# Altium project Wiring Harness 2019.PrjPcb
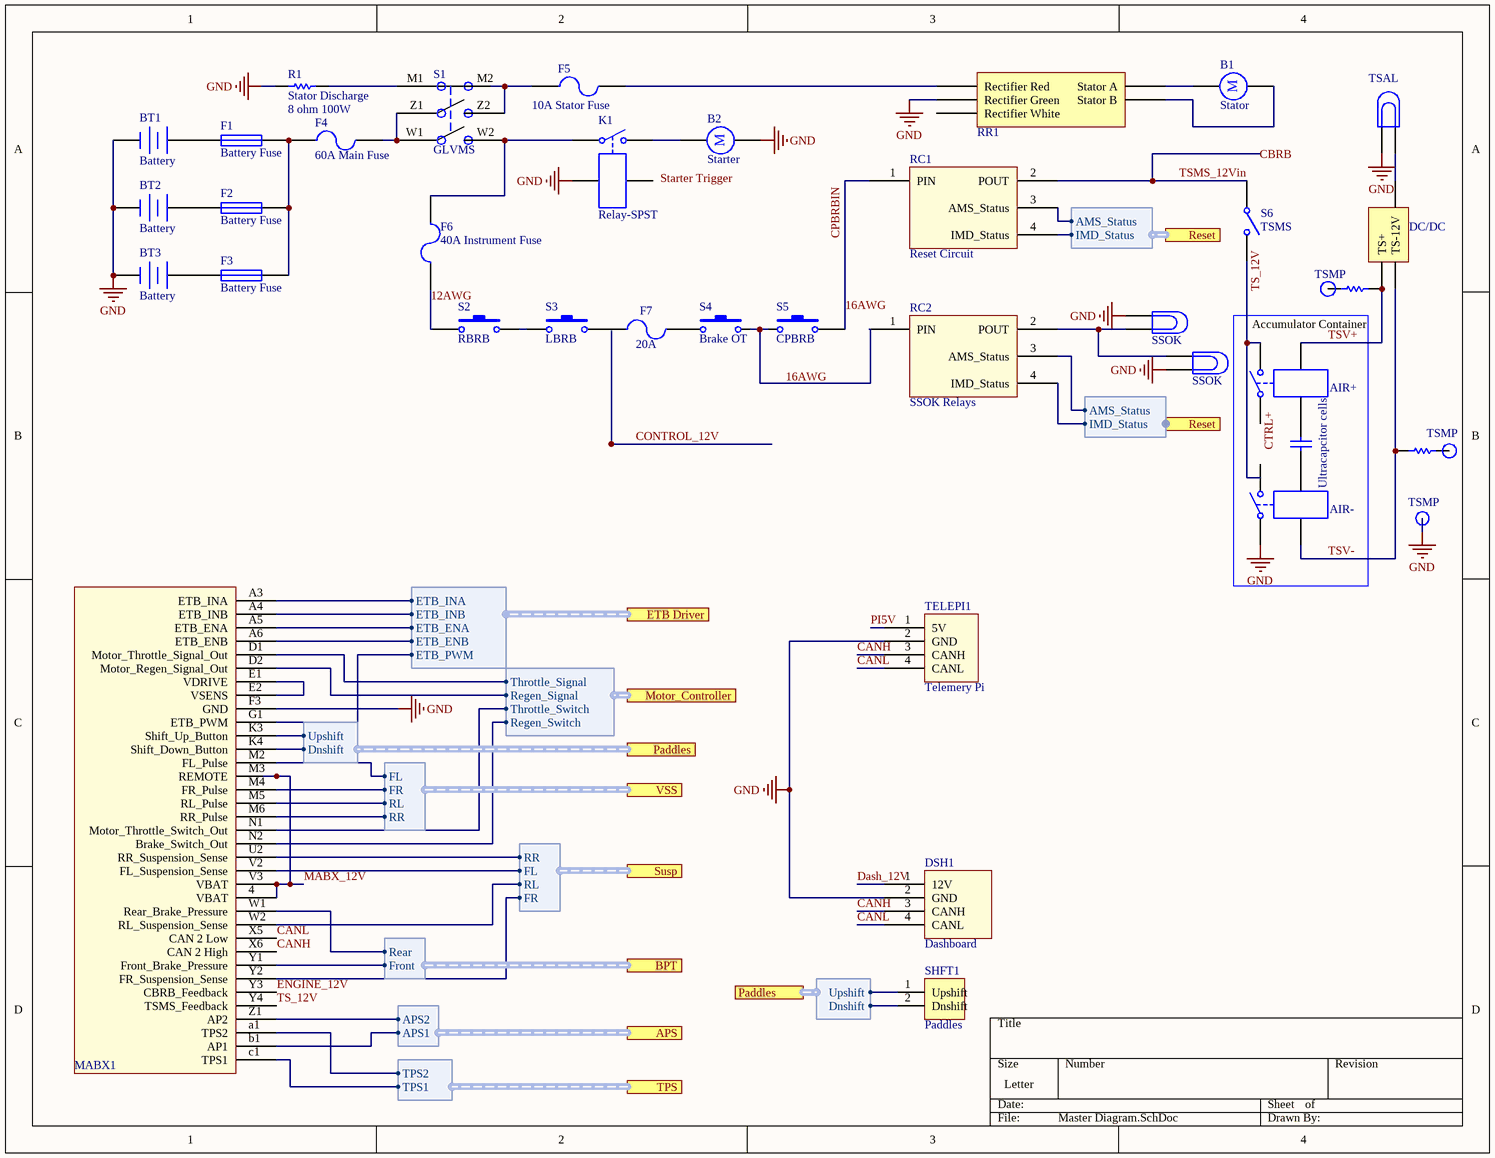
[diagram p0: Master Diagram.SchDoc]
5 sheets, 79 parts. Net scope: flat (ports and power ports of the same name join across sheets).
Sheets:
  Master Diagram.SchDoc
  VD Sensors.SchDoc
  ICE.SchDoc
  TS.SchDoc
  Power.SchDoc

## Sheet Master Diagram.SchDoc
size Letter

### Parts
(Parts that share a designator on the sheet are numbered #1, #2 ... from top to bottom, then left to right.)
B1  Stator  [RB5-10.5]
B2  Starter  [RB5-10.5]
BT1  Battery  [BAT-2]
BT2  Battery  [BAT-2]
BT3  Battery  [BAT-2]
C1  Ultracapcitor cells  [RAD-0.3]
DS1  SSOK  [PIN2]
DS2  SSOK  [PIN2]
DS3#1  TSAL  [PIN2]
DSH1  Dashboard
F1  Battery Fuse  [PIN-W2/E2.8]
F2  Battery Fuse  [PIN-W2/E2.8]
F3  Battery Fuse  [PIN-W2/E2.8]
F4  60A Main Fuse  [PIN-W2/E2.8]
F5  10A Stator Fuse  [PIN-W2/E2.8]
F6  40A Instrument Fuse  [PIN-W2/E2.8]
F7  20A  [PIN-W2/E2.8]
K1  Relay-SPST  [MODULE4]
K3  AIR+  [MODULE4]
K4  AIR-  [MODULE4]
MABX1  MABX  (value not drawn)
P?  DC/DC  [4Pin Molex]
R1  Stator Discharge  value 8 ohm 100W  [AXIAL-0.3]
R5  Res1  [AXIAL-0.3]  (value not drawn)
R6  Res1  [AXIAL-0.3]  (value not drawn)
RC1  Reset Circuit
RC2  SSOK Relays
RR1  Regulator Rectifier  (value not drawn)
S1  GLVMS
S2  RBRB  [SPST-2]
S3  LBRB  [SPST-2]
S4  Brake OT  [SPST-2]
S5  CPBRB  [SPST-2]
S6  TSMS  [SPST-2]
SHFT1  Paddles  [HDR1X2]
TELEPI1  Telemery Pi

### Ports
APS (harness APS), BPT (harness BPT), ETB Driver (harness ETB Harness), Motor_Controller (harness Motor Controller), Paddles (harness Paddles), Reset (harness Reset), Susp (harness Susp), TPS (harness TPS), VSS (harness VSS)

### Harnesses
ETB Harness: ETB_INA, ETB_INB, ETB_ENA, ETB_ENB, ETB_PWM
Motor Controller: Throttle_Signal, Regen_Signal, Throttle_Switch, Regen_Switch
Paddles: Upshift, Dnshift
VSS: FL, FR, RL, RR
Susp: FL, FR, RL, RR
APS: APS2, APS1
TPS: TPS2, TPS1
BPT: Rear, Front
Reset: AMS_Status, IMD_Status

### Nets
GND: B2.2 BT1.2(-) BT2.2(-) BT3.2(-) DS1.1 DS2.2 DS3#1.2 DSH1.2(GND) K1.3 K4.1 MABX1.F3(GND) R1.1 RR1.10(Rectifier_Green) TELEPI1.2(GND)  [project net SENGND]
12AWG: F6.2 S2.1
16AWG: RC1.1(PIN) S5.2
CANH: DSH1.3(CANH) MABX1.X6(CAN_2_High) TELEPI1.3(CANH)
CANL: DSH1.4(CANL) MABX1.X5(CAN_2_Low) TELEPI1.4(CANL)
CBRB: RC1.2(POUT) S6.1(COMMON)  [also labelled TSMS_12Vin]
Dash_12V: DSH1.1(12V)
ENGINE_12V: MABX1.Y3(CBRB_Feedback)
MABX_12V: MABX1.4(VBAT) MABX1.M3(REMOTE) MABX1.V3(VBAT)
PI5V: TELEPI1.1(5V)
TS_12V: MABX1.Y4(TSMS_Feedback)
TSV+: K3.4 P?.4(TS+) R6.2
TSV-: K4.3 P?.2(TS-) R5.1
NetAPS1_3: MABX1.b1(AP1) ; port APS.APS1
NetAPS2_3: MABX1.Z1(AP2) ; port APS.APS2
NetB1_1: B1.1 RR1.7(Stator_A)
NetB1_2: B1.2 RR1.8(Stator_B)
NetB2_1: B2.1 K1.2
NetBPDT1_3: MABX1.Y1(Front_Brake_Pressure) ; port BPT.Front
NetBPDT2_3: MABX1.W1(Rear_Brake_Pressure) ; port BPT.Rear
NetBT1_1: BT1.1(+) F1.1
NetBT2_1: BT2.1(+) F2.1
NetBT3_1: BT3.1(+) F3.1
NetC1_1: C1.1 K4.4
NetC1_2: C1.2 K3.3
NetDS1_2: DS1.2 DS2.1 RC2.2(POUT)
NetDS3#1_1: DS3#1.1 P?.1(12V)
NetESS1_6: RC1.3(AMS_Status) RC2.3(AMS_Status) ; port Reset.AMS_Status
NetETB1_1: MABX1.c1(TPS1) ; port TPS.TPS1
NetETB1_3: MABX1.a1(TPS2) ; port TPS.TPS2
NetETBCTRL1_5: MABX1.A3(ETB_INA) ; port ETB Driver.ETB_INA
NetETBCTRL1_6: MABX1.A5(ETB_ENA) ; port ETB Driver.ETB_ENA
NetETBCTRL1_7: MABX1.G1(ETB_PWM) ; port ETB Driver.ETB_PWM
NetETBCTRL1_9: MABX1.A6(ETB_ENB) ; port ETB Driver.ETB_ENB
NetETBCTRL1_10: MABX1.A4(ETB_INB) ; port ETB Driver.ETB_INB
NetF1_2: F1.2 F2.2 F3.2 F4.1
NetF4_2: F4.2 S1.W1 S1.Z1
NetF5_1: F5.1 S1.M2 S1.Z2
NetF5_2: F5.2 RR1.9(Rectifier_Red)
NetF6_1: F6.1 K1.1 S1.W2
NetIMD1_10: RC1.4(IMD_Status) RC2.4(IMD_Status) ; port Reset.IMD_Status
NetK3_2: K3.2 S6.2(NO)
NetKELLY1_J2-5: MABX1.D1(Motor_Throttle_Signal_Out) ; port Motor_Controller.Throttle_Signal
NetKELLY1_J2-6: MABX1.D2(Motor_Regen_Signal_Out) ; port Motor_Controller.Regen_Signal
NetKELLY1_J2-8: MABX1.N1(Motor_Throttle_Switch_Out) ; port Motor_Controller.Throttle_Switch
NetKELLY1_J2-10: MABX1.N2(Brake_Switch_Out) ; port Motor_Controller.Regen_Switch
NetMABX1_E1: MABX1.E1(VDRIVE) MABX1.E2(VSENS)
NetMABX1_K3: MABX1.K3(Shift_Up_Button) SHFT1.1(Upshift) ; port Paddles.Upshift
NetMABX1_K4: MABX1.K4(Shift_Down_Button) SHFT1.2(Dnshift) ; port Paddles.Dnshift
NetMABX1_M2: MABX1.M2(FL_Pulse) ; port VSS.FL
NetMABX1_M4: MABX1.M4(FR_Pulse) ; port VSS.FR
NetMABX1_M5: MABX1.M5(RL_Pulse) ; port VSS.RL
NetMABX1_M6: MABX1.M6(RR_Pulse) ; port VSS.RR
NetMABX1_U2: MABX1.U2(RR_Suspension_Sense) ; port Susp.RR
NetMABX1_V2: MABX1.V2(FL_Suspension_Sense) ; port Susp.FL
NetMABX1_W2: MABX1.W2(RL_Suspension_Sense) ; port Susp.RL
NetMABX1_Y2: MABX1.Y2(FR_Suspension_Sense) ; port Susp.FR
NetR1_2: R1.2 S1.M1
NetRC2_1: RC2.1(PIN) S4.2 S5.1
NetS2_2: S2.2 S3.1

Not connected (* = marked no-connect by the designer): F7 1 2; K1 4; K3 1; K4 2; P? 3; R5 2; R6 1; RR1 11(Rectifier_White); S3 2; S4 1

### Notes on the sheet
- (near R6) TSMP
- (near R5) TSMP
- Accumulator Container
- Labels drawn without touching a wire or pin: 16AWG, CPBRBIN, CTRL+, Starter Trigger, TS_12V
- (in symbol Motor) M

### Library data of the parts
B1 B2 = Motor: Motor, General Kind; Published: 24-Mar-1999; LatestRevisionDate: 17-Jul-2002; LatestRevisionNote: Re-released for DXP Platform.; PackageReference: RB5-10.5; Publisher: Altium Limited; PackageDescription: Capacitor (Radial); 2 Leads
BT1-BT3 = Battery: Multicell Battery; Published: 24-Mar-1999; LatestRevisionDate: 17-Jul-2002; LatestRevisionNote: Re-released for DXP Platform.; PackageReference: BAT-2; Publisher: Altium Limited; PackageDescription: Battery; 2 Leads
C1 = Cap: Capacitor; Value: 100pF; Published: 8-Jun-2000; LatestRevisionDate: 17-Jul-2002; LatestRevisionNote: Re-released for DXP Platform.; PackageReference: RAD-0.3; Publisher: Altium Limited; PackageDescription: Radial Cap, Thru-Hole; 2 Leads; 0.3 in Pin Spacing
DS1 DS2 DS3#1 = Lamp: Incandescent Bulb; Published: 24-Mar-1999; LatestRevisionDate: 17-Jul-2002; LatestRevisionNote: Re-released for DXP Platform.; PackageReference: PIN2; Publisher: Altium Limited
DSH1 = Dash: Dashboard Connector
F1-F3 = Fuse 1: Fuse; Published: 8-Jun-2000; LatestRevisionDate: 17-Jul-2002; LatestRevisionNote: Re-released for DXP Platform.; PackageReference: PIN-W2/E2.8; Publisher: Altium Limited; PackageDescription: Thru-Hole; 2 Leads
F4-F7 = Fuse 2: Fuse; Published: 8-Jun-2000; LatestRevisionDate: 17-Jul-2002; LatestRevisionNote: Re-released for DXP Platform.; PackageReference: PIN-W2/E2.8; Publisher: Altium Limited; PackageDescription: Thru-Hole; 2 Leads
K1 K3 K4 = Relay-SPST: Single-Pole Single-Throw Relay; Published: 24-Mar-1999; LatestRevisionDate: 17-Jul-2002; LatestRevisionNote: Re-released for DXP Platform.; PackageReference: MODULE4; Publisher: Altium Limited
MABX1 = MABX: MicroAutoBox II in 2019 Layout V1
P? = 4Pin Molex: Supplier Part Number: WM3801-ND
R1 = Res1: Resistor; Published: 8-Jun-2000; LatestRevisionDate: 17-Jul-2002; LatestRevisionNote: Re-released for DXP Platform.; PackageReference: AXIAL-0.3; Publisher: Altium Limited; PackageDescription: Axial Device, Thru-Hole; 2 Leads; 0.3 in Pin Spacing
R5 R6 = Res1: Resistor; Value: 1K; Published: 8-Jun-2000; LatestRevisionDate: 17-Jul-2002; LatestRevisionNote: Re-released for DXP Platform.; PackageReference: AXIAL-0.3; Publisher: Altium Limited; PackageDescription: Axial Device, Thru-Hole; 2 Leads; 0.3 in Pin Spacing
RC1 RC2 = Reset: Reset Circuit for 2019 Rules
RR1 = Stator Rectifier
S2-S5 = SW-PB: Switch; Published: 24-Mar-1999; LatestRevisionDate: 17-Jul-2002; LatestRevisionNote: Re-released for DXP Platform.; PackageReference: SPST-2; Publisher: Altium Limited; PackageDescription: Switch; 2 Leads
S6 = SW-SPST: Single-Pole, Single-Throw Switch; Published: 24-Mar-1999; LatestRevisionDate: 17-Jul-2002; LatestRevisionNote: Re-released for DXP Platform.; PackageReference: SPST-2; Publisher: Altium Limited; PackageDescription: Switch; 2 Leads
SHFT1 = Header 2: Header, 2-Pin; LatestRevisionDate: 17-Jul-2002; LatestRevisionNote: Re-released for DXP Platform.; Publisher: Altium Limited
TELEPI1 = TELEPI: Raspberry Pi used for telemetry

## Sheet VD Sensors.SchDoc
size A4
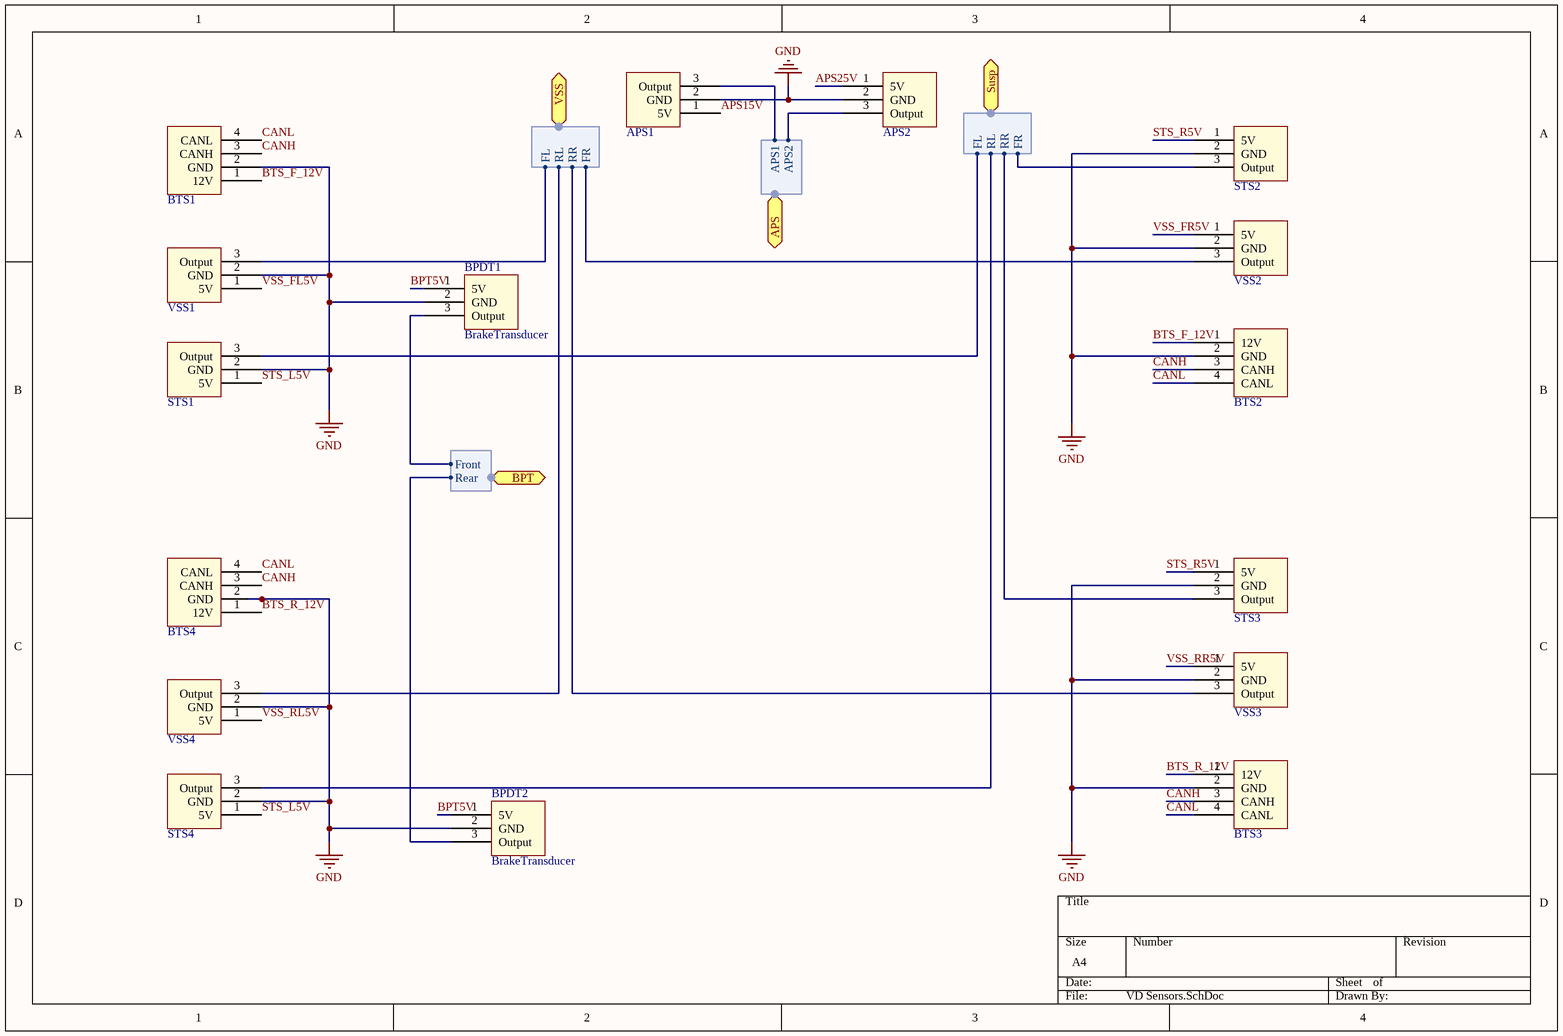
[diagram p1: VD Sensors.SchDoc]

### Parts
APS1  APS  (value not drawn)
APS2  APS  (value not drawn)
BPDT1  BrakeTransducer
BPDT2  BrakeTransducer
BTS1  BTS  (value not drawn)
BTS2  BTS  (value not drawn)
BTS3  BTS  (value not drawn)
BTS4  BTS  (value not drawn)
STS1  Susp  (value not drawn)
STS2  Susp  (value not drawn)
STS3  Susp  (value not drawn)
STS4  Susp  (value not drawn)
VSS1  VSS  (value not drawn)
VSS2  VSS  (value not drawn)
VSS3  VSS  (value not drawn)
VSS4  VSS  (value not drawn)

### Ports
APS (harness APS), BPT (harness BPT), Susp (harness Susp), VSS (harness VSS)

### Harnesses
VSS: FL, FR, RL, RR
Susp: FL, FR, RL, RR
APS: APS2, APS1
BPT: Rear, Front

### Nets
GND: APS1.2(GND) APS2.2(GND) BPDT1.2(GND) BPDT2.2(GND) BTS1.2(GND) BTS2.2(GND) BTS3.2(GND) BTS4.2(GND) STS1.2(GND) STS2.2(GND) STS3.2(GND) STS4.2(GND) VSS1.2(GND) VSS2.2(GND) VSS3.2(GND) VSS4.2(GND)  [project net SENGND]
APS15V: APS1.1(5V)
APS25V: APS2.1(5V)
BPT5V: BPDT1.1(5V) BPDT2.1(5V)
BTS_F_12V: BTS1.1(12V) BTS2.1(12V)
BTS_R_12V: BTS3.1(12V) BTS4.1(12V)
CANH: BTS1.3(CANH) BTS2.3(CANH) BTS3.3(CANH) BTS4.3(CANH)
CANL: BTS1.4(CANL) BTS2.4(CANL) BTS3.4(CANL) BTS4.4(CANL)
STS_L5V: STS1.1(5V) STS4.1(5V)
STS_R5V: STS2.1(5V) STS3.1(5V)
VSS_FL5V: VSS1.1(5V)
VSS_FR5V: VSS2.1(5V)
VSS_RL5V: VSS4.1(5V)
VSS_RR5V: VSS3.1(5V)
NetAPS1_3: APS1.3(Output) ; port APS.APS1
NetAPS2_3: APS2.3(Output) ; port APS.APS2
NetBPDT1_3: BPDT1.3(Output) ; port BPT.Front
NetBPDT2_3: BPDT2.3(Output) ; port BPT.Rear
NetMABX1_M2: VSS1.3(Output) ; port VSS.FL
NetMABX1_M4: VSS2.3(Output) ; port VSS.FR
NetMABX1_M5: VSS4.3(Output) ; port VSS.RL
NetMABX1_M6: VSS3.3(Output) ; port VSS.RR
NetMABX1_U2: STS3.3(Output) ; port Susp.RR
NetMABX1_V2: STS1.3(Output) ; port Susp.FL
NetMABX1_W2: STS4.3(Output) ; port Susp.RL
NetMABX1_Y2: STS2.3(Output) ; port Susp.FR

### Library data of the parts
APS1 APS2 = APS: Accelerator Pedal Sensor
BPDT1 BPDT2 = BrakeTransducer: Brake Pressure Transducer
BTS1-BTS4 = BTS: Brake Temperature Sensor
STS1-STS4 = VSS: Suspension Travel Sensor
VSS1-VSS4 = VSS: Vehicle Speed Sensor

## Sheet ICE.SchDoc
size A4
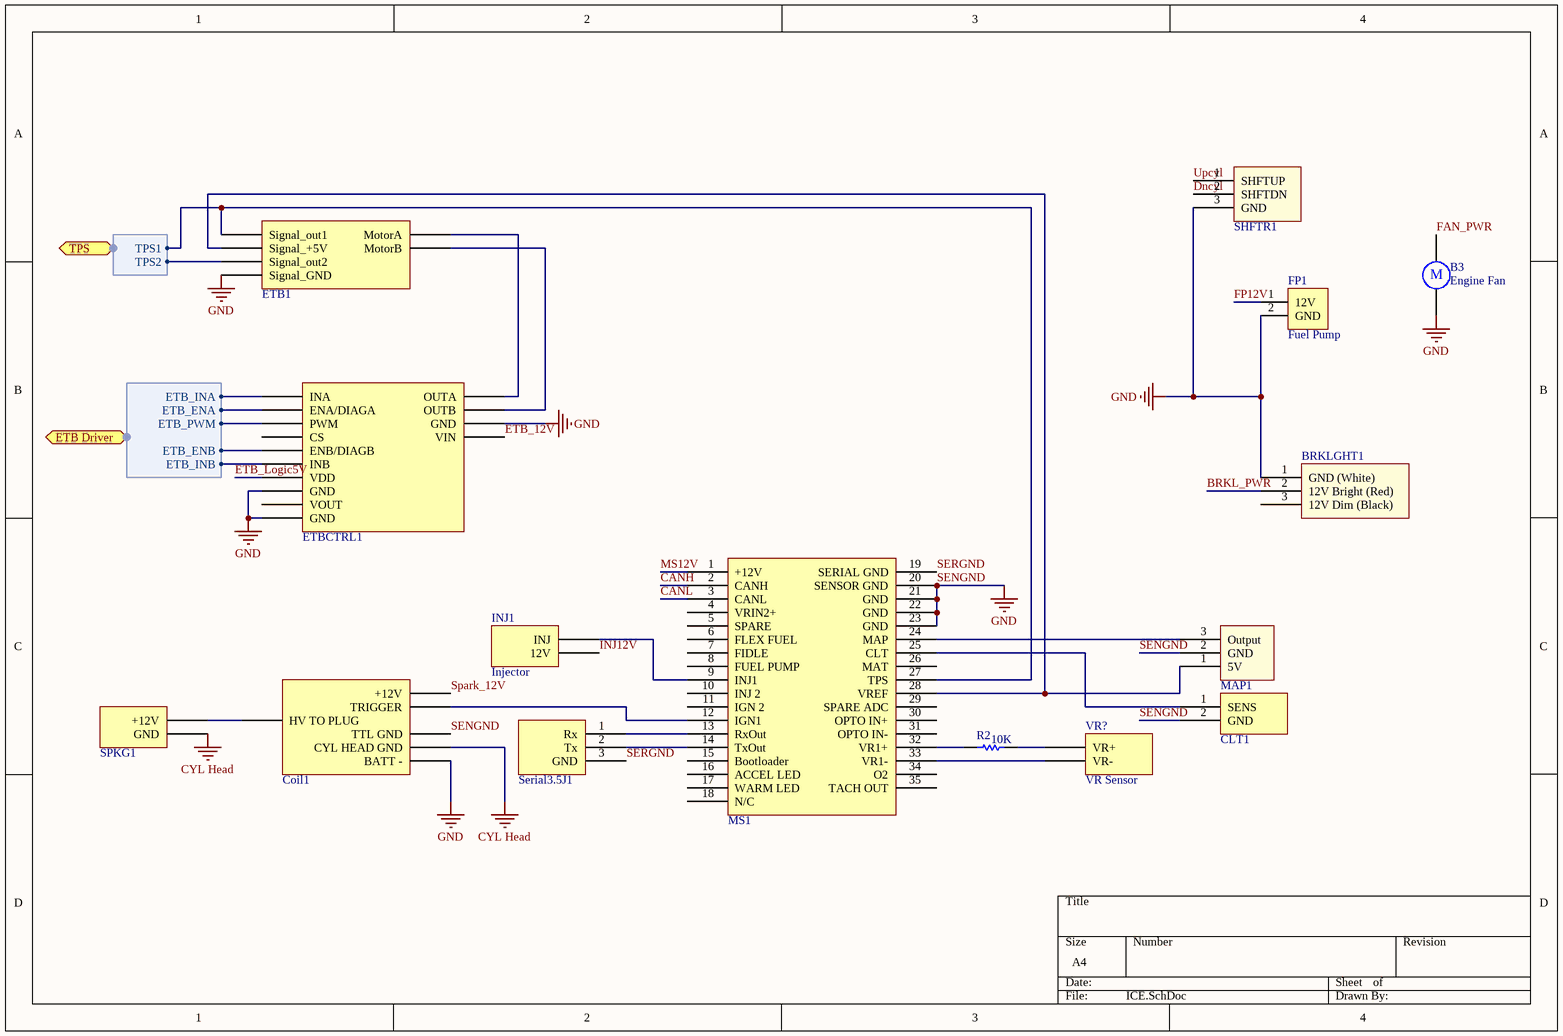
[diagram p2: ICE.SchDoc]

### Parts
B3  Engine Fan  [RB5-10.5]
BRKLGHT1  BRKLGHT  (value not drawn)
CLT1  CLT  (value not drawn)
Coil1  Spark Plug Coil  (value not drawn)
ETB1  ETB  (value not drawn)
ETBCTRL1  ETB Controller  (value not drawn)
FP1  Fuel Pump  [HDR1X2]
INJ1  Injector
MAP1  MAP  (value not drawn)
MS1  Microsquirt  (value not drawn)
R2  value 10K  [AXIAL-0.3]  (hidden comment: Res1)
Serial3.5J1  Serial Jack  (value not drawn)
SHFTR1  Shifter  (value not drawn)
SPKG1  Spark Plug  (value not drawn)
VR?  VR Sensor

### Ports
ETB Driver (harness ETB Harness), TPS (harness TPS)

### Harnesses
ETB Harness: ETB_INA, ETB_INB, ETB_ENA, ETB_ENB, ETB_PWM
TPS: TPS2, TPS1

### Nets
CYL Head: Coil1.6(CYL_HEAD_GND) SPKG1.2(GND)
SENGND: B3.2 BRKLGHT1.1(GND_(White)) CLT1.2(GND) Coil1.2(TTL_GND) Coil1.4(BATT_-) ETB1.4(Signal_GND) ETBCTRL1.3(GND) ETBCTRL1.12(GND) ETBCTRL1.14(GND) FP1.2(GND) MAP1.2(GND) MS1.20(SENSOR_GND) MS1.21(GND) MS1.22(GND) MS1.23(GND) SHFTR1.3(GND)  [also labelled GND]
BRKL_PWR: BRKLGHT1.2(12V_Bright_(Red))
CANH: MS1.2(CANH)
CANL: MS1.3(CANL)
Dncyl: SHFTR1.2(SHFTDN)
ETB_12V: ETBCTRL1.4(VIN)
ETB_Logic5V: ETBCTRL1.11(VDD)
FAN_PWR: B3.1
FP12V: FP1.1(12V)
INJ12V: INJ1.2(12V)
MS12V: MS1.1(+12V)
SERGND: MS1.19(SERIAL_GND) Serial3.5J1.3(GND)
Spark_12V: Coil1.1(+12V)
Upcyl: SHFTR1.1(SHFTUP)
NetCLT1_1: CLT1.1(SENS) MS1.25(CLT)
NetCoil1_3: Coil1.3(HV_TO_PLUG) SPKG1.1(+12V)
NetCoil1_5: Coil1.5(TRIGGER) MS1.12(IGN1)
NetETB1_1: ETB1.1(Signal_out1) MS1.27(TPS) ; port TPS.TPS1
NetETB1_2: ETB1.2(Signal_+5V) MAP1.1(5V) MS1.28(VREF)
NetETB1_3: ETB1.3(Signal_out2) ; port TPS.TPS2
NetETB1_5: ETB1.5(MotorA) ETBCTRL1.1(OUTA)
NetETB1_6: ETB1.6(MotorB) ETBCTRL1.2(OUTB)
NetETBCTRL1_5: ETBCTRL1.5(INA) ; port ETB Driver.ETB_INA
NetETBCTRL1_6: ETBCTRL1.6(ENA/DIAGA) ; port ETB Driver.ETB_ENA
NetETBCTRL1_7: ETBCTRL1.7(PWM) ; port ETB Driver.ETB_PWM
NetETBCTRL1_9: ETBCTRL1.9(ENB/DIAGB) ; port ETB Driver.ETB_ENB
NetETBCTRL1_10: ETBCTRL1.10(INB) ; port ETB Driver.ETB_INB
NetINJ1_1: INJ1.1(INJ) MS1.9(INJ1)
NetMAP1_3: MAP1.3(Output) MS1.24(MAP)
NetMS1_13: MS1.13(RxOut) Serial3.5J1.1(Rx)
NetMS1_14: MS1.14(TxOut) Serial3.5J1.2(Tx)
NetMS1_32: MS1.32(VR1+) R2.1
NetMS1_33: MS1.33(VR1-) VR?.2(VR-)
NetR2_2: R2.2 VR?.1(VR+)

Not connected (* = marked no-connect by the designer): BRKLGHT1 3(12V_Dim_(Black)); ETBCTRL1 8(CS) 13(VOUT); MS1 4(VRIN2+) 5(SPARE) 6(FLEX_FUEL) 7(FIDLE) 8(FUEL_PUMP) 10(INJ_2) 11(IGN_2) 15(Bootloader) 16(ACCEL_LED) 17(WARM_LED) 18(N/C) 26(MAT) 29(SPARE_ADC) 30(OPTO_IN+) 31(OPTO_IN-) 34(O2) 35(TACH_OUT)

### Notes on the sheet
- (in symbol Motor) M

### Library data of the parts
B3 = Motor: Motor, General Kind; Published: 24-Mar-1999; LatestRevisionDate: 17-Jul-2002; LatestRevisionNote: Re-released for DXP Platform.; PackageReference: RB5-10.5; Publisher: Altium Limited; PackageDescription: Capacitor (Radial); 2 Leads
BRKLGHT1 = BRKLGHT: Brake light with dim and bright operation
CLT1 = CLT: Coolant Temperature Sensor
ETB1 = ETB: Electronic Throttle Body
ETBCTRL1 = ETB Controller: ETB Controller Board
FP1 = Header 2: Header, 2-Pin; LatestRevisionDate: 17-Jul-2002; LatestRevisionNote: Re-released for DXP Platform.; Publisher: Altium Limited
MAP1 = VSS: Manifold Air Pressure Sensor
MS1 = Microsquirt: Microsquirt EFI Controller
R2 = Res1: Resistor; Published: 8-Jun-2000; LatestRevisionDate: 17-Jul-2002; LatestRevisionNote: Re-released for DXP Platform.; PackageReference: AXIAL-0.3; Publisher: Altium Limited; PackageDescription: Axial Device, Thru-Hole; 2 Leads; 0.3 in Pin Spacing
Serial3.5J1 = Serial Connector: Serial Connector on a 3.5mm plug
SHFTR1 = SHFTR: Shifter Connector
SPKG1 = Spark Plug: Spark Plug with HV Lead Connector
VR? = VR Sensor: Variable Reluctance Sensor

## Sheet TS.SchDoc
size A4
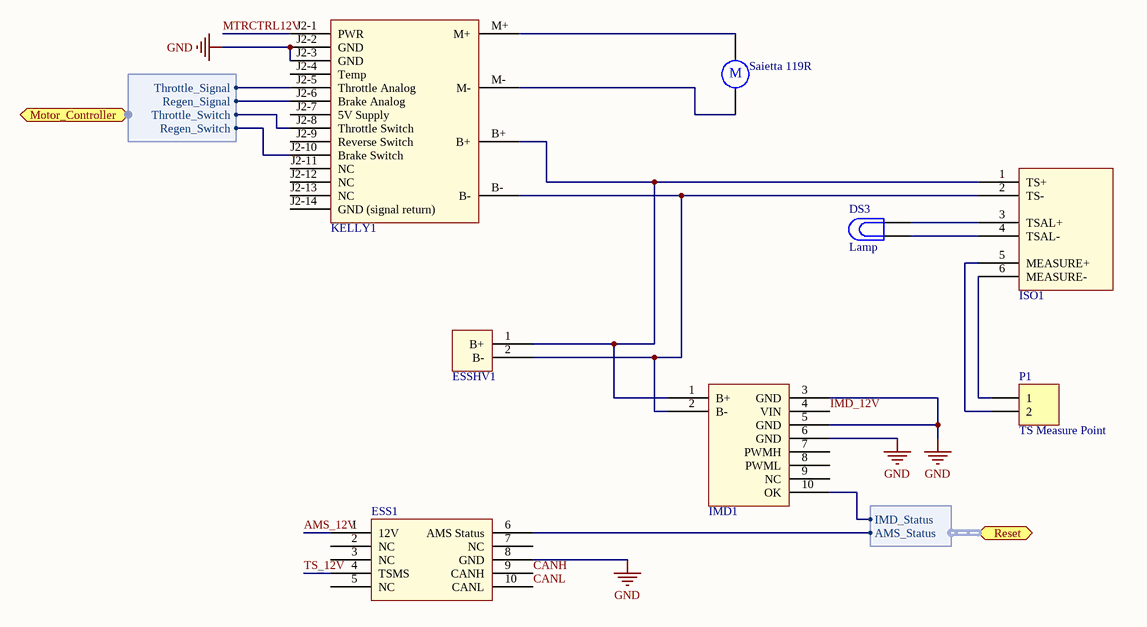
[diagram p3: TS.SchDoc]

### Parts
(Parts that share a designator on the sheet are numbered #1, #2 ... from top to bottom, then left to right.)
B4  Saietta 119R  [RB5-10.5]
DS3#2  Lamp  [PIN2]
ESS1  (no value)
ESSHV1  ESS High Voltage  (value not drawn)
IMD1  IMD  (value not drawn)
ISO1  Isolation Board  (value not drawn)
KELLY1  Kelly MC  (value not drawn)
P1  TS Measure Point  [HDR1X2]

### Ports
Motor_Controller (harness Motor Controller), Reset (harness Reset)

### Harnesses
Motor Controller: Throttle_Signal, Regen_Signal, Throttle_Switch, Regen_Switch
Reset: AMS_Status, IMD_Status

### Nets
GND: ESS1.8(GND) IMD1.3(GND) IMD1.5(GND) IMD1.6(GND) KELLY1.J2-2(GND) KELLY1.J2-3(GND)  [project net SENGND]
AMS_12V: ESS1.1(12V)
CANH: ESS1.9(CANH)
CANL: ESS1.10(CANL)
IMD_12V: IMD1.4(VIN)
MTRCTRL12V: KELLY1.J2-1(PWR)
TS_12V: ESS1.4(TSMS)
NetB4_1: B4.1 KELLY1.M+
NetB4_2: B4.2 KELLY1.M-
NetDS3#2_1: DS3#2.1 ISO1.4(TSAL-)
NetDS3#2_2: DS3#2.2 ISO1.3(TSAL+)
NetESS1_6: ESS1.6(AMS_Status) ; port Reset.AMS_Status
NetESSHV1_1: ESSHV1.1(B+) IMD1.1(B+) ISO1.1(TS+) KELLY1.B+
NetESSHV1_2: ESSHV1.2(B-) IMD1.2(B-) ISO1.2(TS-) KELLY1.B-
NetIMD1_10: IMD1.10(OK) ; port Reset.IMD_Status
NetISO1_5: ISO1.5(MEASURE+) P1.2
NetISO1_6: ISO1.6(MEASURE-) P1.1
NetKELLY1_J2-5: KELLY1.J2-5(Throttle_Analog) ; port Motor_Controller.Throttle_Signal
NetKELLY1_J2-6: KELLY1.J2-6(Brake_Analog) ; port Motor_Controller.Regen_Signal
NetKELLY1_J2-8: KELLY1.J2-8(Throttle_Switch) ; port Motor_Controller.Throttle_Switch
NetKELLY1_J2-10: KELLY1.J2-10(Brake_Switch) ; port Motor_Controller.Regen_Switch

Not connected (* = marked no-connect by the designer): ESS1 2(NC) 3(NC) 5(NC) 7(NC); IMD1 7(PWMH) 8(PWML) 9(NC); KELLY1 J2-4(Temp) J2-7(5V_Supply) J2-9(Reverse_Switch) J2-11(NC) J2-12(NC) J2-13(NC) J2-14(GND_(signal_return))

### Notes on the sheet
- (in symbol Motor) M

### Library data of the parts
B4 = Motor: Motor, General Kind; Published: 24-Mar-1999; LatestRevisionDate: 17-Jul-2002; LatestRevisionNote: Re-released for DXP Platform.; PackageReference: RB5-10.5; Publisher: Altium Limited; PackageDescription: Capacitor (Radial); 2 Leads
DS3#2 = Lamp: Incandescent Bulb; Published: 24-Mar-1999; LatestRevisionDate: 17-Jul-2002; LatestRevisionNote: Re-released for DXP Platform.; PackageReference: PIN2; Publisher: Altium Limited
ESS1 = ESS 10pin
ESSHV1 = ESS HV
IMD1 = IMD: Insulation Monitoring Device
ISO1 = ISO
KELLY1 = Kelly HPM: Kelly KPM 12601 Functional Pinout
P1 = Header 2: Header, 2-Pin; LatestRevisionDate: 17-Jul-2002; LatestRevisionNote: Re-released for DXP Platform.; Publisher: Altium Limited

## Sheet Power.SchDoc
size A4
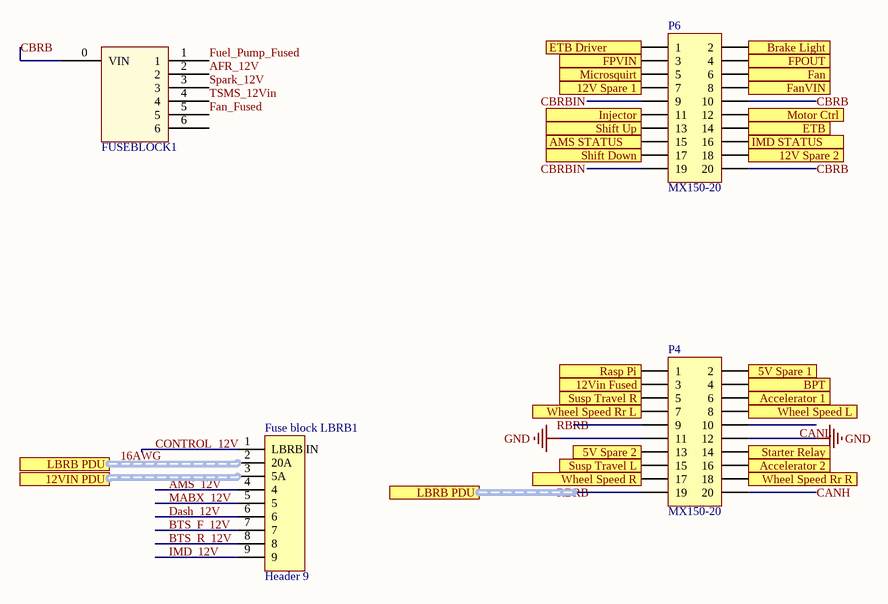
[diagram p4: Power.SchDoc]

### Parts
Fuse_block_LBRB1  Header 9  [HDR1X9]
FUSEBLOCK1  FuseBlock  (value not drawn)
P4  MX150-20  [MX150 20 PIN]
P6  MX150-20  [MX150 20 PIN]

### Ports
5V Spare 1, 5V Spare 2, 12V Spare 1, 12V Spare 2, 12Vin Fused, 12VIN PDU (harness Reset), Accelerator 1, Accelerator 2, AMS STATUS, BPT, Brake Light, ETB, ETB Driver, Fan, FanVIN, FPOUT, FPVIN, IMD STATUS, Injector, LBRB PDU (harness Reset), Microsquirt, Motor Ctrl, Rasp Pi, Shift Down, Shift Up, Starter Relay, Susp Travel L, Susp Travel R, Wheel Speed L, Wheel Speed R, Wheel Speed Rr L, Wheel Speed Rr R

### Nets
GND: P4.11 P4.12  [project net SENGND]
AFR_12V: FUSEBLOCK1.2
CANH: P4.20
CANL: P4.10
CBRB: FUSEBLOCK1.0(VIN) P6.10 P6.20
CBRBIN: P6.9 P6.19
Fan_Fused: FUSEBLOCK1.5
Fuel_Pump_Fused: FUSEBLOCK1.1
RBRB: P4.9 P4.19
Spark_12V: FUSEBLOCK1.3
TSMS_12Vin: FUSEBLOCK1.4
NetP4_1: P4.1 ; port Rasp Pi
NetP4_2: P4.2 ; port 5V Spare 1
NetP4_3: P4.3 ; port 12Vin Fused
NetP4_4: P4.4 ; port BPT
NetP4_5: P4.5 ; port Susp Travel R
NetP4_6: P4.6 ; port Accelerator 1
NetP4_7: P4.7 ; port Wheel Speed Rr L
NetP4_8: P4.8 ; port Wheel Speed L
NetP4_13: P4.13 ; port 5V Spare 2
NetP4_14: P4.14 ; port Starter Relay
NetP4_15: P4.15 ; port Susp Travel L
NetP4_16: P4.16 ; port Accelerator 2
NetP4_17: P4.17 ; port Wheel Speed R
NetP4_18: P4.18 ; port Wheel Speed Rr R
NetP6_1: P6.1 ; port ETB Driver
NetP6_2: P6.2 ; port Brake Light
NetP6_3: P6.3 ; port FPVIN
NetP6_4: P6.4 ; port FPOUT
NetP6_5: P6.5 ; port Microsquirt
NetP6_6: P6.6 ; port Fan
NetP6_7: P6.7 ; port 12V Spare 1
NetP6_8: P6.8 ; port FanVIN
NetP6_11: P6.11 ; port Injector
NetP6_12: P6.12 ; port Motor Ctrl
NetP6_13: P6.13 ; port Shift Up
NetP6_14: P6.14 ; port ETB
NetP6_15: P6.15 ; port AMS STATUS
NetP6_16: P6.16 ; port IMD STATUS
NetP6_17: P6.17 ; port Shift Down
NetP6_18: P6.18 ; port 12V Spare 2

Not connected (* = marked no-connect by the designer): Fuse_block_LBRB1 1(LBRB_IN) 2(20A) 3(5A) 4 5 6 7 8 9; FUSEBLOCK1 6

### Buses and harness runs
harness 16AWG = port LBRB PDU

### Notes on the sheet
- Labels drawn without touching a wire or pin: AMS_12V, BTS_F_12V, BTS_R_12V, CONTROL_12V, Dash_12V, IMD_12V, MABX_12V

### Library data of the parts
Fuse_block_LBRB1 = Header 9: Header, 9-Pin; LatestRevisionDate: 17-Jul-2002; LatestRevisionNote: Re-released for DXP Platform.; Publisher: Altium Limited
FUSEBLOCK1 = FuseBlock: Iztor 6 Way Light Fuse Box Block; Link: https://www.amazon.ca/Terminal-Single-Package-Accessories-Motorhomes/dp/B074K1TJNL/ref=sr_1_9?s=electronics&ie=UTF8&qid=1544502475&sr=1-9&keywords=6+way+fuse+box
P4 P6 = Header 10X2: Header, 10-Pin, Dual row; LatestRevisionDate: 17-Jul-2002; LatestRevisionNote: Re-released for DXP Platform.; Publisher: Altium Limited; Supplier Part Number: WM12752-ND

## Nets that join several sheets
SENGND: Master Diagram (14 pins), VD Sensors (16 pins), ICE (16 pins), TS (6 pins), Power (P4.11 P4.12)
NetAPS1_3: Master Diagram (MABX1.b1), VD Sensors (APS1.3)
NetAPS2_3: Master Diagram (MABX1.Z1), VD Sensors (APS2.3)
NetBPDT1_3: Master Diagram (MABX1.Y1), VD Sensors (BPDT1.3)
NetBPDT2_3: Master Diagram (MABX1.W1), VD Sensors (BPDT2.3)
NetESS1_6: Master Diagram (RC1.3 RC2.3), TS (ESS1.6)
NetETB1_1: Master Diagram (MABX1.c1), ICE (ETB1.1 MS1.27)
NetETB1_3: Master Diagram (MABX1.a1), ICE (ETB1.3)
NetETBCTRL1_5: Master Diagram (MABX1.A3), ICE (ETBCTRL1.5)
NetETBCTRL1_6: Master Diagram (MABX1.A5), ICE (ETBCTRL1.6)
NetETBCTRL1_7: Master Diagram (MABX1.G1), ICE (ETBCTRL1.7)
NetETBCTRL1_9: Master Diagram (MABX1.A6), ICE (ETBCTRL1.9)
NetETBCTRL1_10: Master Diagram (MABX1.A4), ICE (ETBCTRL1.10)
NetIMD1_10: Master Diagram (RC1.4 RC2.4), TS (IMD1.10)
NetKELLY1_J2-5: Master Diagram (MABX1.D1), TS (KELLY1.J2-5)
NetKELLY1_J2-6: Master Diagram (MABX1.D2), TS (KELLY1.J2-6)
NetKELLY1_J2-8: Master Diagram (MABX1.N1), TS (KELLY1.J2-8)
NetKELLY1_J2-10: Master Diagram (MABX1.N2), TS (KELLY1.J2-10)
NetMABX1_M2: Master Diagram (MABX1.M2), VD Sensors (VSS1.3)
NetMABX1_M4: Master Diagram (MABX1.M4), VD Sensors (VSS2.3)
NetMABX1_M5: Master Diagram (MABX1.M5), VD Sensors (VSS4.3)
NetMABX1_M6: Master Diagram (MABX1.M6), VD Sensors (VSS3.3)
NetMABX1_U2: Master Diagram (MABX1.U2), VD Sensors (STS3.3)
NetMABX1_V2: Master Diagram (MABX1.V2), VD Sensors (STS1.3)
NetMABX1_W2: Master Diagram (MABX1.W2), VD Sensors (STS4.3)
NetMABX1_Y2: Master Diagram (MABX1.Y2), VD Sensors (STS2.3)